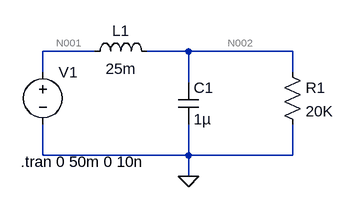
[diagram p0: schematic diagrama.asc]
diagrama.asc, the LTspice schematic file:
Version 4
SHEET 1 880 680
WIRE 16 -16 -64 -16
WIRE 160 -16 96 -16
WIRE 320 -16 160 -16
WIRE -64 16 -64 -16
WIRE 320 16 320 -16
WIRE 160 32 160 -16
WIRE -64 144 -64 96
WIRE 160 144 160 96
WIRE 160 144 -64 144
WIRE 320 144 320 96
WIRE 320 144 160 144
WIRE 160 176 160 144
FLAG 160 176 0
SYMBOL cap 144 32 R0
SYMATTR InstName C1
SYMATTR Value 1µ
SYMBOL res 304 0 R0
SYMATTR InstName R1
SYMATTR Value 20K
SYMBOL ind 0 0 R270
WINDOW 0 32 56 VTop 2
WINDOW 3 5 56 VBottom 2
SYMATTR InstName L1
SYMATTR Value 25m
SYMBOL voltage -64 0 R0
WINDOW 123 0 0 Left 0
WINDOW 39 0 0 Left 0
WINDOW 3 24 96 Invisible 2
SYMATTR InstName V1
SYMATTR Value PULSE(0 1000 0 1n 1n 1u 1002n 1)
TEXT -98 154 Left 2 !.tran 0 50m 0 10n

The netlist it stands for:
* diagrama.asc
C1 N002 0 1µ
R1 N002 0 20K
L1 N001 N002 25m
V1 N001 0 PULSE(0 1000 0 1n 1n 1u 1002n 1)
.tran 0 50m 0 10n
.backanno
.end

* Results of the author's LTspice run, read from the files saved beside the schematic
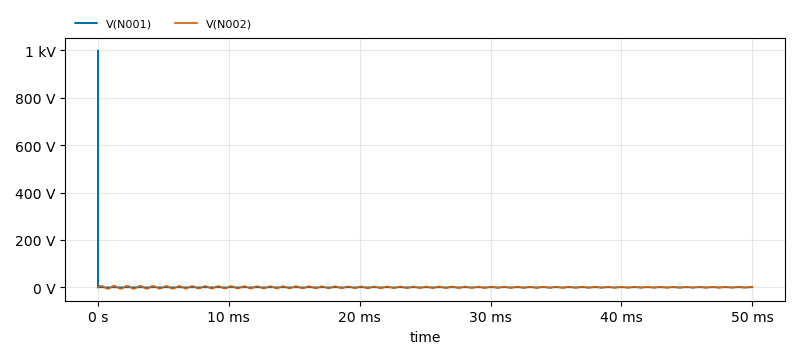
[diagram p1: Transient Analysis of diagrama.asc, plotted from the saved traces]
* Transient Analysis, 1 run:
*   V(N001): min 0 V, max 1 kV, average 20.02 mV, rms 4.474 V, last 0 V
*   V(N002): min -6.214 V, max 6.292 V, average 22.7 mV, rms 2.712 V, last 1.597 V